# Altium schematic sheet RcMPPT-Power_Module.SchDoc
size A4; Organization: Altium Limited; Address1: L3, 12a Rodborough Rd; Address2: Frenchs Forest; Address3: NSW; Address4: Australia 2086; SheetNumber: 3; SheetTotal: 5
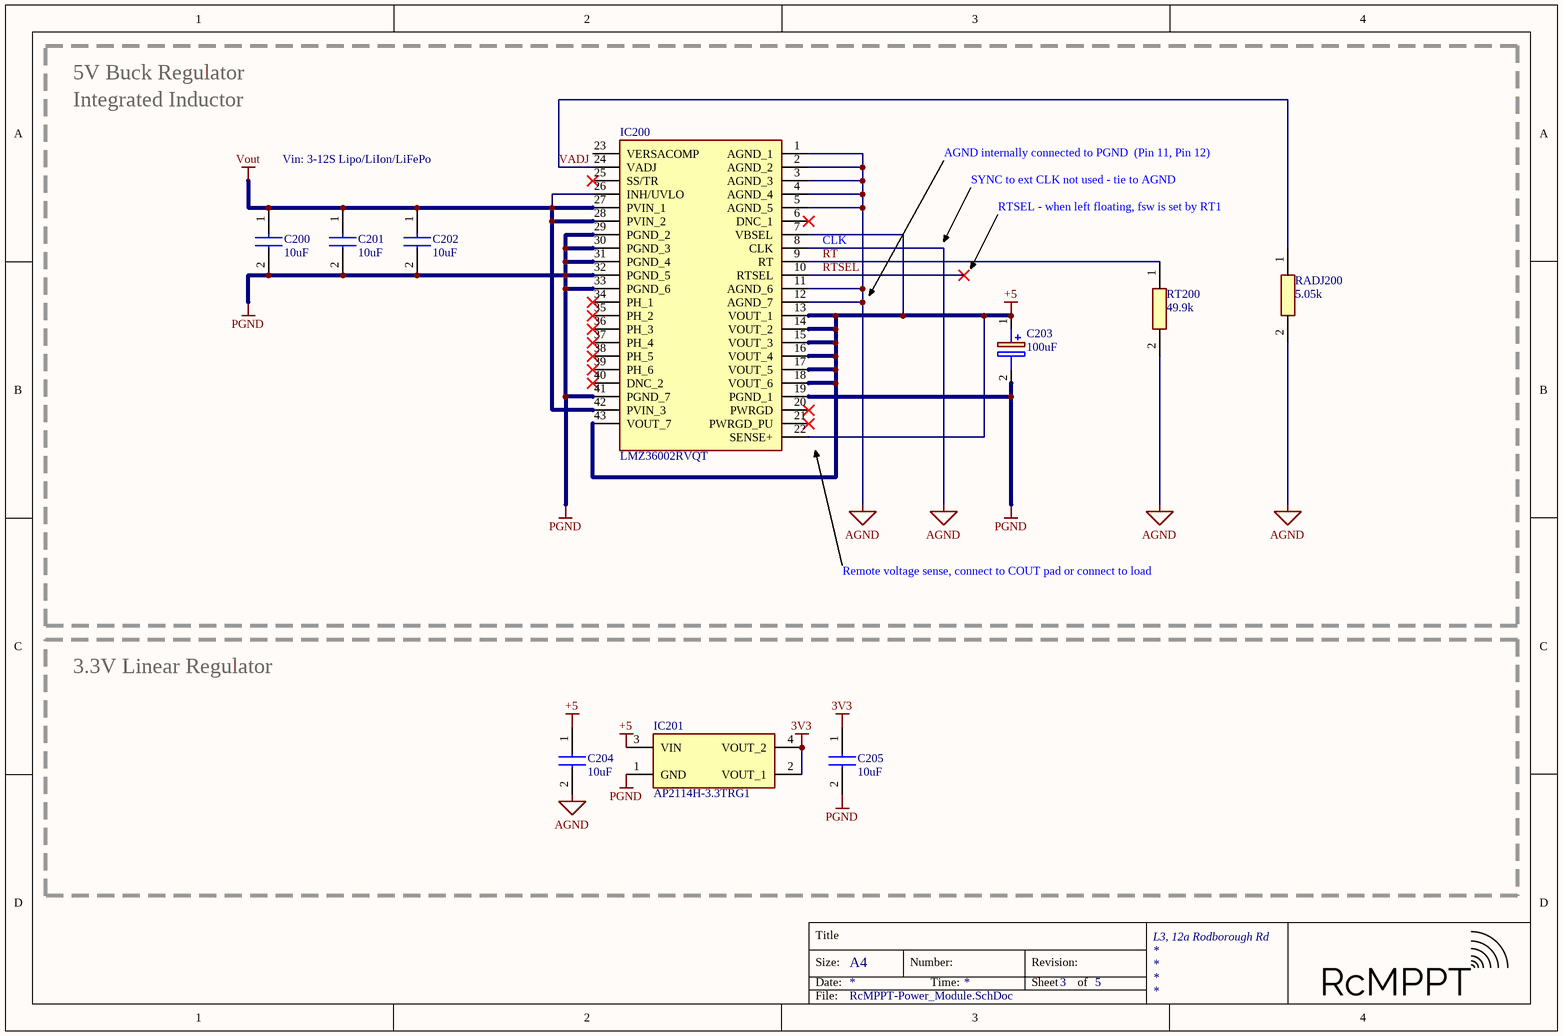
[diagram p0: RcMPPT-Power_Module.SchDoc]

## Parts
C200  10uF  [CAPC3225X280N]
C201  10uF  [CAPC3225X280N]
C202  10uF  [CAPC3225X280N]
C203  100uF  [CAPPM3528X200N]
C204  10uF  [CAPC3225X280N]
C205  10uF  [CAPC3225X280N]
IC200  LMZ36002RVQT  [LMZ36002RVQR]
IC201  AP2114H-3.3TRG1  [SOT230P700X180-4N]
RADJ200  5.05k  [R0805]
RT200  49.9k  [R0805]

## Blocks framed on the sheet
3.3V Linear Regulator: C204 C205 IC201

## Nets
3V3: C205.1 IC201.2(VOUT_1) IC201.4(VOUT_2)
+5: C203.1(+) C204.1 IC200.7(VBSEL) IC200.13(VOUT_1) IC200.14(VOUT_2) IC200.15(VOUT_3) IC200.16(VOUT_4) IC200.17(VOUT_5) IC200.18(VOUT_6) IC200.22(SENSE+) IC200.43(VOUT_7) IC201.3(VIN)
AGND: C204.2 IC200.1(AGND_1) IC200.2(AGND_2) IC200.3(AGND_3) IC200.4(AGND_4) IC200.5(AGND_5) IC200.8(CLK) IC200.11(AGND_6) IC200.12(AGND_7) RADJ200.2 RT200.2
PGND: C200.2 C201.2 C202.2 C203.2(-) C205.2 IC200.19(PGND_1) IC200.29(PGND_2) IC200.30(PGND_3) IC200.31(PGND_4) IC200.32(PGND_5) IC200.33(PGND_6) IC200.41(PGND_7) IC201.1(GND)
Vout: C200.1 C201.1 C202.1 IC200.26(INH/UVLO) IC200.27(PVIN_1) IC200.28(PVIN_2) IC200.42(PVIN_3)
RT: IC200.9(RT) RT200.1
RTSEL: IC200.10(RTSEL)
VADJ: IC200.24(VADJ) RADJ200.1

Not connected (* = marked no-connect by the designer): IC200 6(DNC_1)* 20(PWRGD)* 21(PWRGD_PU)* 23(VERSACOMP) 25(SS/TR)* 34(PH_1)* 35(PH_2)* 36(PH_3)* 37(PH_4)* 38(PH_5)* 39(PH_6)* 40(DNC_2)*

## Notes on the sheet
- 5V Buck Regulator
- Integrated Inductor
- Vin: 3-12S Lipo/LiIon/LiFePo
- AGND internally connected to PGND  (Pin 11, Pin 12)
- (near IC200) CLK
- SYNC to ext CLK not used - tie to AGND
- RTSEL - when left floating, fsw is set by RT1
- Remote voltage sense, connect to COUT pad or connect to load
- Title
- Size:
- Date:
- A4
- Number:
- Time:
- Revision:
- Sheet
- of
- File:

## Library data of the parts
C200-C202 C204 C205 = CL32B106KMVNNWE: Capacitor; Manufacturer_Name: Samsung Electro-Mechanics; Datasheet Link: https://www.arrow.com/en/products/cl32b106kmvnnwe/samsung-electro-mechanics; Height: 2.8mm; Manufacturer_Part_Number: CL32B106KMVNNWE; Arrow Part Number: CL32B106KMVNNWE; Arrow Price/Stock: https://www.arrow.com/en/products/cl32b106kmvnnwe/samsung-electro-mechanics; Mouser Part Number: N/A; Mouser Price/Stock: https://www.mouser.co.uk/ProductDetail/Samsung-Electro-Mechanics/CL32B106KMVNNWE?qs=xZ%2FP%252Ba9zWqaEMBbSgKy8gQ%3D%3D
C203 = 8TPE100MAZB: Capacitor Polarised; Manufacturer_Name: Panasonic; Datasheet Link: http://uk.rs-online.com/web/p/products/7887374; Height: 2mm; Manufacturer_Part_Number: 8TPE100MAZB; Arrow Part Number: 8TPE100MAZB; Arrow Price/Stock: https://www.arrow.com/en/products/8tpe100mazb/panasonic; Mouser Part Number: 667-8TPE100MAZB; Mouser Price/Stock: https://www.mouser.co.uk/ProductDetail/Panasonic/8TPE100MAZB?qs=OE1iw1LrrPHKTwwfsidxgA%3D%3D
IC200 = LMZ36002RVQT: Integrated Circuit; Manufacturer_Name: Texas Instruments; Datasheet Link: http://www.ti.com/lit/gpn/lmz36002; Height: 2.13mm; Manufacturer_Part_Number: LMZ36002RVQT; Arrow Part Number: LMZ36002RVQT; Arrow Price/Stock: https://www.arrow.com/en/products/lmz36002rvqt/texas-instruments; Mouser Part Number: 595-LMZ36002RVQT; Mouser Price/Stock: https://www.mouser.co.uk/ProductDetail/Texas-Instruments/LMZ36002RVQT?qs=kFLL9AfgRSBjXTxBMSjGOw%3D%3D
IC201 = AP2114H-3.3TRG1: Integrated Circuit; Manufacturer_Name: Diodes Inc.; Datasheet Link: http://uk.rs-online.com/web/p/products/8283528; Height: 1.8mm; Manufacturer_Part_Number: AP2114H-3.3TRG1; Arrow Part Number: AP2114H-3.3TRG1; Arrow Price/Stock: https://www.arrow.com/en/products/ap2114h-3.3trg1/diodes-incorporated; Mouser Part Number: 621-AP2114H-3.3TRG1; Mouser Price/Stock: https://www.mouser.co.uk/ProductDetail/Diodes-Incorporated/AP2114H-33TRG1?qs=x6A8l6qLYDDSG%2FfwzcsOhw%3D%3D
RADJ200 = RT0805BRD075K05L: Resistor; Manufacturer_Name: Yageo; Datasheet Link: https://www.mouser.at/datasheet/2/447/PYu-RT_1-to-0.01_RoHS_L_11-1669912.pdf; Height: 0.7mm; Manufacturer_Part_Number: RT0805BRD075K05L; Mouser Part Number: 603-RT0805BRD075K05L; Mouser Price/Stock: https://www.mouser.at/ProductDetail/Yageo/RT0805BRD075K05L?qs=bQfrgN9vNvwObDVrZ%2FDM5w%3D%3D
RT200 = ERJ-6ENF4992V: Resistor; Manufacturer_Name: Panasonic; Datasheet Link: https://industrial.panasonic.com/cdbs/www-data/pdf/RDA0000/AOA0000C84.pdf; Height: 0.7mm; Manufacturer_Part_Number: ERJ-6ENF4992V; Mouser Part Number: 667-ERJ-6ENF4992V; Mouser Price/Stock: https://www.mouser.com/Search/Refine.aspx?Keyword=667-ERJ-6ENF4992V